# Altium schematic sheet Touch_6Buttons.SchDoc: Touch button electrode
size B; Author: Sebastien Gelinas; Organization: SmartHalo; Address1: 5445 de Gaspé; Address2: Montréal, QC; Address3: Canada; Address4: H2T 3B2; Revision: 1; SheetNumber: 1; SheetTotal: 1
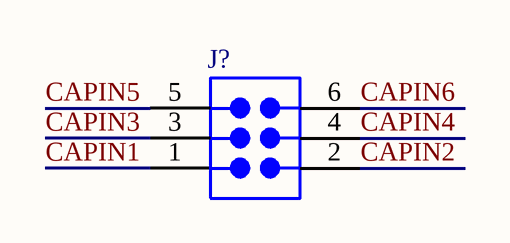
[diagram p0: Touch_6Buttons.SchDoc]

## Parts
J?  FLEX-FCI59453061110ECHLF  [FLEX-FCI5945306111CHLF]  (value not drawn)  (no BOM)

## Nets
CAPIN1: J?.1
CAPIN2: J?.2
CAPIN3: J?.3
CAPIN4: J?.4
CAPIN5: J?.5
CAPIN6: J?.6

## Notes on the sheet
- Title
- Size:
- Date:
- B
- Author:
- Time:
- Sheet
- Revision:
- of
- File:

## Library data of the parts
J? = FLEX-FCI59453061110ECHLF: Flex Connector, to connect to FPC, 0.5 mm pitch, 6 contacts